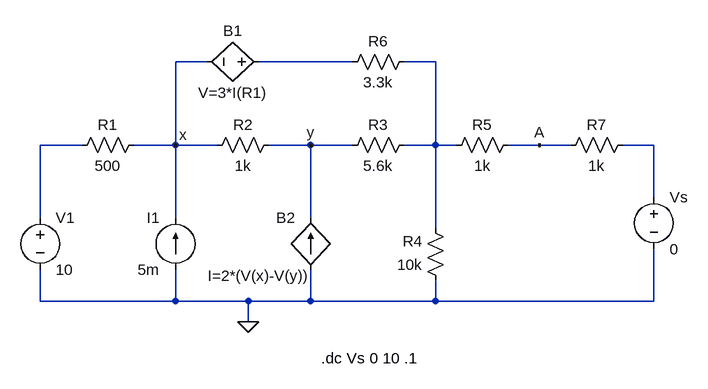
[diagram p0: schematic Lab05Circuit04.asc]
Lab05Circuit04.asc, the LTspice schematic file:
Version 4
SHEET 1 1048 680
WIRE 304 -128 256 -128
WIRE 528 -128 384 -128
WIRE 656 -128 608 -128
WIRE 112 0 48 0
WIRE 256 0 256 -128
WIRE 256 0 192 0
WIRE 320 0 256 0
WIRE 464 0 400 0
WIRE 528 0 464 0
WIRE 656 0 656 -128
WIRE 656 0 608 0
WIRE 688 0 656 0
WIRE 816 0 768 0
WIRE 864 0 816 0
WIRE 992 0 944 0
WIRE 992 80 992 0
WIRE 48 112 48 0
WIRE 256 112 256 0
WIRE 464 112 464 0
WIRE 656 128 656 0
WIRE 48 240 48 192
WIRE 256 240 256 192
WIRE 256 240 48 240
WIRE 368 240 256 240
WIRE 464 240 464 192
WIRE 464 240 368 240
WIRE 656 240 656 208
WIRE 656 240 464 240
WIRE 992 240 992 160
WIRE 992 240 656 240
WIRE 368 272 368 240
FLAG 368 272 0
FLAG 256 0 x
FLAG 464 0 y
FLAG 816 0 A
SYMBOL voltage 48 96 R0
WINDOW 123 0 0 Left 0
WINDOW 39 0 0 Left 0
SYMATTR InstName V1
SYMATTR Value 10
SYMBOL current 256 192 R180
WINDOW 0 24 80 Left 2
WINDOW 3 24 0 Left 2
SYMATTR InstName I1
SYMATTR Value 5m
SYMBOL res 208 -16 R90
WINDOW 0 0 56 VBottom 2
WINDOW 3 32 56 VTop 2
SYMATTR InstName R1
SYMATTR Value 500
SYMBOL res 416 -16 R90
WINDOW 0 0 56 VBottom 2
WINDOW 3 32 56 VTop 2
SYMATTR InstName R2
SYMATTR Value 1k
SYMBOL res 624 -16 R90
WINDOW 0 0 56 VBottom 2
WINDOW 3 32 56 VTop 2
SYMATTR InstName R3
SYMATTR Value 5.6k
SYMBOL res 672 224 R180
WINDOW 0 36 76 Left 2
WINDOW 3 36 40 Left 2
SYMATTR InstName R4
SYMATTR Value 10k
SYMBOL res 624 -144 R90
WINDOW 0 0 56 VBottom 2
WINDOW 3 32 56 VTop 2
SYMATTR InstName R6
SYMATTR Value 3.3k
SYMBOL bv 400 -128 R90
WINDOW 0 -32 56 VBottom 2
WINDOW 3 32 56 VTop 2
SYMATTR InstName B1
SYMATTR Value V=3*I(R1)
SYMBOL bi 464 192 R180
WINDOW 0 24 80 Left 2
WINDOW 3 2 -9 Left 2
SYMATTR InstName B2
SYMATTR Value I=2*(V(x)-V(y))
SYMBOL res 672 16 R270
WINDOW 0 32 56 VTop 2
WINDOW 3 0 56 VBottom 2
SYMATTR InstName R5
SYMATTR Value 1k
SYMBOL res 960 -16 R90
WINDOW 0 0 56 VBottom 2
WINDOW 3 32 56 VTop 2
SYMATTR InstName R7
SYMATTR Value 1k
SYMBOL voltage 992 64 R0
WINDOW 123 0 0 Left 0
WINDOW 39 0 0 Left 0
SYMATTR InstName Vs
SYMATTR Value 0
TEXT 480 328 Left 2 !.dc Vs 0 10 .1

The netlist it stands for:
* Lab05Circuit04.asc
V1 N003 0 10
I1 0 x 5m
R1 x N003 500
R2 y x 1k
R3 N002 y 5.6k
R4 0 N002 10k
R6 N002 N001 3.3k
B1 N001 x V=3*I(R1)
B2 0 y I=2*(V(x)-V(y))
R5 N002 A 1k
R7 N004 A 1k
Vs N004 0 0
.dc Vs 0 10 .1
.backanno
.end

* Results of the author's LTspice run, read from the files saved beside the schematic
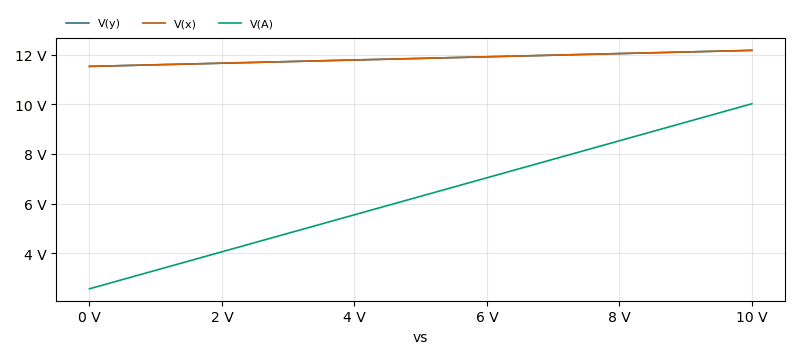
[diagram p1: DC transfer characteristic of Lab05Circuit04.asc, plotted from the saved traces]
* DC transfer characteristic, 1 run:
*   V(y): 11.53 V at vs=0 V, 12.18 V at vs=10 V, min 11.53 V, max 12.18 V
*   V(x): 11.53 V at vs=0 V, 12.18 V at vs=10 V, min 11.53 V, max 12.18 V
*   V(A): 2.568 V at vs=0 V, 10.02 V at vs=10 V, min 2.568 V, max 10.02 V